# Altium schematic sheet MCU.SchDoc
size A3; Date: 01/12/2021; DrawnBy: Can Güveren; SheetNumber: 2; SheetTotal: 4; PageSize: A3
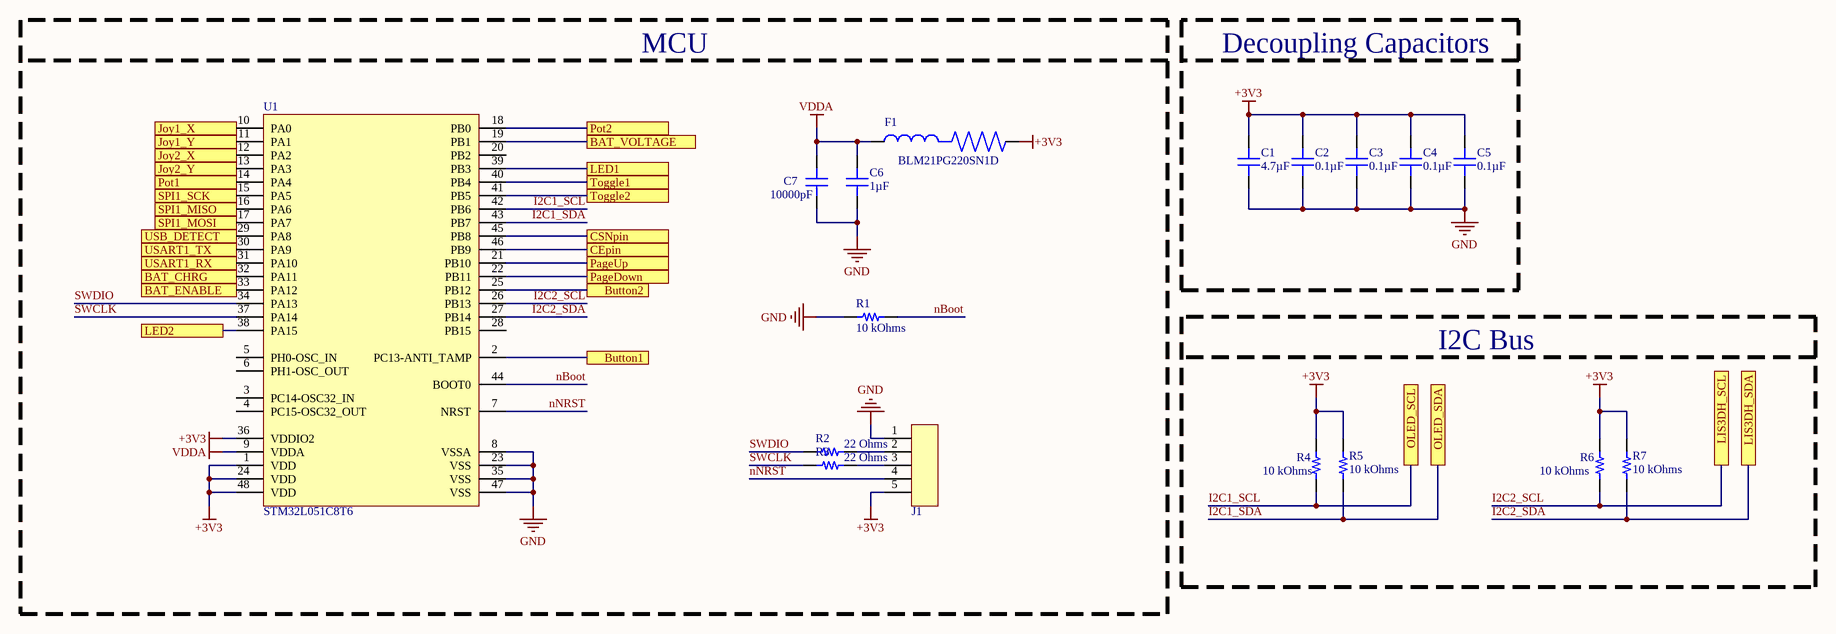
[diagram p0: MCU.SchDoc]

## Parts
C1  4.7µF  [CAP 0603_1608]
C2  0.1µF  [CAP 0603_1608]
C3  0.1µF  [CAP 0603_1608]
C4  0.1µF  [CAP 0603_1608]
C5  0.1µF  [CAP 0603_1608]
C6  1µF  [CAP 0603_1608]
C7  10000pF  [CAP 0603_1608]
F1  BLM21PG220SN1D  [BLM21PG220SN1D]
J1  Header-90 Degree-5x1  [Header-90 Degree-5P]  (value not drawn)
R1  10 kOhms  [RES 0603_1608]
R2  22 Ohms  [RES 0603_1608]
R3  22 Ohms  [RES 0603_1608]
R4  10 kOhms  [RES 0603_1608]
R5  10 kOhms  [RES 0603_1608]
R6  10 kOhms  [RES 0603_1608]
R7  10 kOhms  [RES 0603_1608]
U1  STM32L051C8T6  [LQFP-48]

## Blocks framed on the sheet
MCU: C6 C7 F1 J1 R1-R3 U1
Decoupling Capacitors: C1-C5
I2C Bus: R4-R7

## Ports
BAT_CHRG, BAT_ENABLE, BAT_VOLTAGE, Button1, Button2, CEpin, CSNpin, Joy1_X, Joy1_Y, Joy2_X, Joy2_Y, LED1, LED2, LIS3DH_SCL, LIS3DH_SDA, OLED_SCL, OLED_SDA, PageDown, PageUp, Pot1, Pot2, SPI1_MISO, SPI1_MOSI, SPI1_SCK, Toggle1, Toggle2, USART1_RX, USART1_TX, USB_DETECT

## Nets
+3V3: C1.2 C2.2 C3.2 C4.2 C5.2 F1.2 J1.5 R4.2 R5.2 R6.2 R7.2 U1.1(VDD) U1.24(VDD) U1.36(VDDIO2) U1.48(VDD)
GND: C1.1 C2.1 C3.1 C4.1 C5.1 C6.1 C7.1 J1.1 R1.1 U1.8(VSSA) U1.23(VSS) U1.35(VSS) U1.47(VSS)
VDDA: C6.2 C7.2 F1.1 U1.9(VDDA)
BAT_CHRG: U1.32(PA11) ; port BAT_CHRG
BAT_ENABLE: U1.33(PA12) ; port BAT_ENABLE
BAT_VOLTAGE: U1.19(PB1) ; port BAT_VOLTAGE
Button1: U1.2(PC13-ANTI_TAMP) ; port Button1
Button2: U1.25(PB12) ; port Button2
CEpin: U1.46(PB9) ; port CEpin
CSNpin: U1.45(PB8) ; port CSNpin
I2C1_SCL: R4.1 U1.42(PB6) ; port OLED_SCL
I2C1_SDA: R5.1 U1.43(PB7) ; port OLED_SDA
I2C2_SCL: R6.1 U1.26(PB13) ; port LIS3DH_SCL
I2C2_SDA: R7.1 U1.27(PB14) ; port LIS3DH_SDA
Joy1_X: U1.10(PA0) ; port Joy1_X
Joy1_Y: U1.11(PA1) ; port Joy1_Y
Joy2_X: U1.12(PA2) ; port Joy2_X
Joy2_Y: U1.13(PA3) ; port Joy2_Y
LED1: U1.39(PB3) ; port LED1
LED2: U1.38(PA15) ; port LED2
nBoot: R1.2 U1.44(BOOT0)
nNRST: J1.4 U1.7(NRST)
PageDown: U1.22(PB11) ; port PageDown
PageUp: U1.21(PB10) ; port PageUp
Pot1: U1.14(PA4) ; port Pot1
Pot2: U1.18(PB0) ; port Pot2
SPI1_MISO: U1.16(PA6) ; port SPI1_MISO
SPI1_MOSI: U1.17(PA7) ; port SPI1_MOSI
SPI1_SCK: U1.15(PA5) ; port SPI1_SCK
SWCLK: R3.1 U1.37(PA14)
SWDIO: R2.1 U1.34(PA13)
Toggle1: U1.40(PB4) ; port Toggle1
Toggle2: U1.41(PB5) ; port Toggle2
USART1_RX: U1.31(PA10) ; port USART1_RX
USART1_TX: U1.30(PA9) ; port USART1_TX
USB_DETECT: U1.29(PA8) ; port USB_DETECT
NetJ1_2: J1.2 R2.2
NetJ1_3: J1.3 R3.2

Not connected (* = marked no-connect by the designer): U1 3(PC14-OSC32_IN) 4(PC15-OSC32_OUT) 5(PH0-OSC_IN) 6(PH1-OSC_OUT) 20(PB2) 28(PB15)

## Notes on the sheet
- Project Name
- Draw By
- Date
- Size
- Number

## Library data of the parts
C1 = LMK107BJ475KA-T: CAP CER 4.7UF 10V X5R 0603; Manufacturer: Taiyo Yuden; Tolerance: ±10%; Part Number: LMK107BJ475KA-T; Value: 4.7µF; Applications: General Purpose; Capacitance: 4.7µF; ComponentLink1Description: Datasheet; ComponentLink1URL: https://ds.yuden.co.jp/TYCOMPAS/ut/detail?pn=LMK107BJ475KA-T  &u=M; ComponentLink2Description: DigiKey Link; ComponentLink2URL: http://digikey.com/product-detail/en/taiyo-yuden/LMK107BJ475KA-T/587-1441-1-ND/1004072; Device Package: 0603 (1608 Metric); LastUpdated: 2.09.2020 01:03:36; Lifecycle Status: Active; Minimum Order: 1; Mounting Type: Surface Mount, MLCC; Operating Temperature: -55°C ~ 85°C; Package / Case: 0603 (1608 Metric); Packaging: TapeAndReel; PartId: 2244; Part Status: Active; Price: 0.03; Series: M; Size / Dimension: 0.063" L x 0.031" W (1.60mm x 0.80mm); Supplier 1: DigiKey; Supplier Part Number 1: 587-1441-1-ND; Temperature Coefficient: X5R; Thickness (Max): 0.035" (0.90mm); Voltage - Rated: 10V
C2-C5 = 0603Y0160104KXT: CAP CER 0.10UF 16V X7R 0603; Manufacturer: Knowles Syfer; Temperature Coefficient: X7R (2R1); Tolerance: ±10%; Part Number: 0603Y0160104KXT; Value: 0.1µF; Applications: High Reliability, Boardflex Sensitive; Capacitance: 0.1µF; ComponentLink1Description: Datasheet; ComponentLink1URL: https://www.knowlescapacitors.com/getattachment/2dbfc8bc-e2b3-4b4d-afb1-43b011b9ebe0/High-Std-Voltage.aspx; ComponentLink2Description: DigiKey Link; ComponentLink2URL: http://digikey.com/product-detail/en/knowles-syfer/0603Y0160104KXT/1608-1363-1-ND/7644465; Device Package: 0603 (1608 Metric); Features: Soft Termination, High Temperature; LastUpdated: 2.09.2020 01:03:34; Lifecycle Status: Active; Minimum Order: 1; Mounting Type: Surface Mount, MLCC; Operating Temperature: -55°C ~ 125°C; Package / Case: 0603 (1608 Metric); Packaging: TapeAndReel; PartId: 2921; Part Status: Active; Price: 0.16; Series: FlexiCap™; Size / Dimension: 0.063" L x 0.031" W (1.60mm x 0.80mm); Supplier 1: DigiKey; Supplier Part Number 1: 1608-1363-1-ND; Thickness (Max): 0.031" (0.80mm); Voltage - Rated: 16V
C6 = C0603C105K4RACAUTO: CAP CER 0603 1UF 16V X7R 10%; Manufacturer: KEMET; Part Number: C0603C105K4RACAUTO; Value: 1µF; Applications: Automotive, Bypass, Decoupling; Capacitance: 1µF; ComponentLink1Description: Datasheet; ComponentLink1URL: https://api.kemet.com/component-edge/download/datasheet/C0603C105K4RACAUTO.pdf; ComponentLink2Description: DigiKey Link; ComponentLink2URL: http://digikey.com/product-detail/en/kemet/C0603C105K4RACAUTO/399-17704-1-ND/8635855; Device Package: 0603 (1608 Metric); LastUpdated: 2.09.2020 01:03:36; Lifecycle Status: Active; Minimum Order: 1; Mounting Type: Surface Mount, MLCC; Operating Temperature: -55°C ~ 125°C; Package / Case: 0603 (1608 Metric); Packaging: TapeAndReel; PartId: 2179; Part Status: Active; Price: 0.02; Ratings: AEC-Q200; Series: SMD Auto X7R; Size / Dimension: 0.063" L x 0.031" W (1.60mm x 0.80mm); Supplier 1: DigiKey; Supplier Part Number 1: 399-17704-1-ND; Temperature Coefficient: X7R; Thickness (Max): 0.037" (0.95mm); Tolerance: ±10%; Voltage - Rated: 16V
C7 = C0603C103K4RECAUTO: CAP CER 0603 10NF 16V X7R 10%; Manufacturer: KEMET; Part Number: C0603C103K4RECAUTO; Value: 10000pF; Applications: Automotive, ESD Protection; Capacitance: 10000pF; ComponentLink1Description: Datasheet; ComponentLink1URL: https://api.kemet.com/component-edge/download/datasheet/C0603C103K4RECAUTO.pdf; ComponentLink2Description: DigiKey Link; ComponentLink2URL: http://digikey.com/product-detail/en/kemet/C0603C103K4RECAUTO/399-17880-1-ND/8640547; Device Package: 0603 (1608 Metric); LastUpdated: 2.09.2020 01:03:25; Lifecycle Status: Active; Minimum Order: 1; Mounting Type: Surface Mount, MLCC; Operating Temperature: -55°C ~ 125°C; Package / Case: 0603 (1608 Metric); Packaging: TapeAndReel; PartId: 8251; Part Status: Active; Price: 0.02; Ratings: AEC-Q200; Series: ESD SMD Auto X7R; Size / Dimension: 0.063" L x 0.031" W (1.60mm x 0.80mm); Supplier 1: DigiKey; Supplier Part Number 1: 399-17880-1-ND; Temperature Coefficient: X7R; Thickness (Max): 0.034" (0.87mm); Tolerance: ±10%; Voltage - Rated: 16V
F1 = BLM21PG220SN1D: Ferrite Beads Multi-Layer 22Ohm 25% 100MHz 6A 9mOhm DCR 0805 Paper T/R; Manufacturer: Murata; Manufacturer Series: BLM21P; Material: Steel,Ferrite; Impedance: 22R; DC Resistance (DCR): 9mR; Shielding: Unshielded; Number of Circuits: 1; Resistance: 10mR; Supplier 1: Digi-Key; Manufacturer Part Number: BLM21PG220SN1D; RoHS: Yes; Category: Ferrite Beads and Chips; Pricing 1: 1=0,13000, 10=0,10300, 25=0,09320, 50=0,06820, 100=0,05890, 250=0,04652, 500=0,03930, 1000=0,03309 (USD); Case/Package: 0805; Number of Pins: 2; Core Material: Ferrite; Case Code (Metric): 2012; Case Code (Imperial): 0805; Weight: 0.000194oz; Terminal Finish: Tin; Min Operating Temperature: -55°C; Max Operating Temperature: 125°C; Tolerance: 25%; Packaging: Tape and Reel; Current Rating: 6A; Max DC Current: 6A; Number of Lines: 1; Package Quantity: 1; Max Current Rating: 6A; Termination: SMD/SMT; Test Frequency: 100MHz; DC Current: 6A; Series: BLM21P; DC Resistance-Max: 9mR; Number of Functions: 1; Length: 2mm; Width: 1.25mm; Height: 0.85mm; Depth: 1.25mm; Radiation Hardening: No; REACH SVHC: No SVHC; Lead Free: Lead Free; RoHS Compliant: Yes; ComponentLink1URL: https://datasheet.ciiva.com/14122/anblm21p-data-e-14122211.pdf?src-supplier=Distrelec; ComponentLink1Description: https://datasheet.ciiva.com/14122/anblm21p-data-e-14122211.pdf?src-supplier=Distrelec; ComponentLink2URL: https://datasheet.ciiva.com/11799/0900766b81275e31-11799177.pdf?src-supplier=RSComponents; ComponentLink2Description: https://datasheet.ciiva.com/11799/0900766b81275e31-11799177.pdf?src-supplier=RSComponents; ComponentLink3URL: https://datasheet.ciiva.com/29700/1845312-29700540.pdf?src-supplier=Jameco; ComponentLink3Description: https://datasheet.ciiva.com/29700/1845312-29700540.pdf?src-supplier=Jameco; ComponentLink4URL: https://datasheet.ciiva.com/3081/l0110s0100blm21p-3081653.pdf?src-supplier=Avnet; ComponentLink4Description: https://datasheet.ciiva.com/3081/l0110s0100blm21p-3081653.pdf?src-supplier=Avnet; ComponentLink5URL: https://datasheet.ciiva.com/8021/5160-8021589.pdf?src-supplier=Element14; ComponentLink5Description: https://datasheet.ciiva.com/8021/5160-8021589.pdf?src-supplier=Element14; ComponentLink6URL: https://datasheet.ciiva.com/16291/l0110s0100blm21p-16291622.pdf?src-supplier=Future+Electronics; ComponentLink6Description: https://datasheet.ciiva.com/16291/l0110s0100blm21p-16291622.pdf?src-supplier=Future+Electronics; ComponentLink7URL: https://datasheet.ciiva.com/8021/5160-8021591.pdf?src-supplier=Element14; ComponentLink7Description: https://datasheet.ciiva.com/8021/5160-8021591.pdf?src-supplier=Element14; ComponentLink8URL: https://datasheet.ciiva.com/6211/l0110s0100blm21p-6211741.pdf?src-supplier=Digi-Key; ComponentLink8Description: https://datasheet.ciiva.com/6211/l0110s0100blm21p-6211741.pdf?src-supplier=Digi-Key; ComponentLink9URL: https://datasheet.ciiva.com/41449/001171738-da-01-en-chip-drossel0805-22r0-6000ma-2-0x1-25mm-41449366.pdf?src-supplier=Conrad; ComponentLink9Description: https://datasheet.ciiva.com/41449/001171738-da-01-en-chip-drossel0805-22r0-6000ma-2-0x1-25mm-41449366.pdf?src-supplier=Conrad; Supplier Part Number 1: 490-5987-6-ND
R1 R4-R7 = RNCS0603BKE10K0: RES 10K OHM 0.1% 1/16W 0603; Manufacturer: Stackpole Electronics Inc; Power (Watts): 0.063W, 1/16W; Temperature Coefficient: ±25ppm/°C; Part Number: RNCS0603BKE10K0; Value: 10 kOhms; ComponentLink1Description: Datasheet; ComponentLink1URL: https://www.seielect.com/catalog/sei-rncs_rnch.pdf; ComponentLink2Description: DigiKey Link; ComponentLink2URL: http://digikey.com/product-detail/en/stackpole-electronics-inc/RNCS0603BKE10K0/RNCS0603BKE10K0CT-ND/1800113; Composition: Thin Film; Device Package: 0603 (1608 Metric); Features: Anti-Corrosive, Automotive AEC-Q200, Moisture Resistant; Height - Seated (Max): 0.022" (0.55mm); LastUpdated: 2.09.2020 01:10:25; Lifecycle Status: Active; Minimum Order: 1; Number of Terminations: 2; Operating Temperature: -55°C ~ 155°C; Package / Case: 0603 (1608 Metric); Packaging: TapeAndReel; PartId: 4838; Part Status: Active; Price: 0.08; Ratings: AEC-Q200; Resistance: 10 kOhms; Series: RNCS; Size / Dimension: 0.061" L x 0.031" W (1.55mm x 0.80mm); Supplier 1: DigiKey; Supplier Part Number 1: RNCS0603BKE10K0CT-ND; Supplier Device Package: 0603; Tolerance: ±0.1%
R2 R3 = ERJ-3EKF22R0V: RES SMD 22 OHM 1% 1/10W 0603; Manufacturer: Panasonic Electronic Components; Power (Watts): 0.1W, 1/10W; Temperature Coefficient: ±100ppm/°C; Part Number: ERJ-3EKF22R0V; Value: 22 Ohms; ComponentLink1Description: Datasheet; ComponentLink1URL: https://industrial.panasonic.com/cdbs/www-data/pdf/RDA0000/AOA0000C304.pdf; ComponentLink2Description: DigiKey Link; ComponentLink2URL: http://digikey.com/product-detail/en/panasonic-electronic-components/ERJ-3EKF22R0V/P22.0HCT-ND/1746745; Composition: Thick Film; Device Package: 0603 (1608 Metric); Features: Automotive AEC-Q200; Height - Seated (Max): 0.022" (0.55mm); LastUpdated: 2.09.2020 01:10:23; Lifecycle Status: Active; Minimum Order: 1; Number of Terminations: 2; Operating Temperature: -55°C ~ 155°C; Package / Case: 0603 (1608 Metric); Packaging: TapeAndReel; PartId: 5655; Part Status: Active; Price: 0.01; Ratings: AEC-Q200; Resistance: 22 Ohms; Series: ERJ; Size / Dimension: 0.063" L x 0.031" W (1.60mm x 0.80mm); Supplier 1: DigiKey; Supplier Part Number 1: P22.0HCT-ND; Supplier Device Package: 0603; Tolerance: ±1%
U1 = STM32L051C8T6: MCU 32-Bit Ultra Low Power STM32L ARM Cortex M0+ RISC 64kB Flash 48-Pin LQFP Tray; Manufacturer: STMicroelectronics; Max Power Dissipation: 363mW; Interface: I2C,SPI,IrDA,UART,USART,I2S; Number of I/Os: 37; Number of Timers/Counters: 5; RAM Size: 8KB; Frequency: 32MHz; Oscillator Type: Internal; Max Supply Voltage: 3.6V; Data Bus Width: 32b; Watchdog Timer: Yes; Peripherals: Brown-out Detect/Reset,POR,PWM,WDT,DMA; Supplier 1: Digi-Key; Manufacturer Part Number: STM32L051C8T6; RoHS: Yes; Category: Microcontrollers; Pricing 1: 1=4,40000, 10=3,95400, 25=3,73840, 80=3,24000, 250=3,07380, 500=2,76920 (USD); Case/Package: LQFP; Number of Pins: 48; Min Operating Temperature: -40°C; Max Operating Temperature: 85°C; Packaging: Tray; Number of Programmable I/O: 37; Max Frequency: 32MHz; Memory Type: FLASH; Memory Size: 64KB; Core Architecture: ARM; REACH SVHC: No SVHC; Lead Free: Lead Free; RoHS Compliant: Yes; ComponentLink1URL: https://datasheet.ciiva.com/48492/dm00108219-48492460.pdf?src-supplier=Avnet; ComponentLink1Description: https://datasheet.ciiva.com/48492/dm00108219-48492460.pdf?src-supplier=Avnet; Supplier Part Number 1: 497-14900-ND